# Altium schematic sheet pec.SchDoc: Parallella LCD Board
size A4; Author: Mateusz Majchrzycki; CompanyName: Antmicro Ltd; Address1: Zwierzyniecka 3; Address2: 60-813 Poznań; Address3: Poland; Address4: 60-813 Poznań, Poland; Revision: 2.1; SheetNumber: 1; SheetTotal: 2; PageSetup: Record=PageOptions|CenterHorizontal=True|CenterVertical=True|PrintScale=0.97|XCorrection=1.00|YCorrection=1.00|PrintKind=1|BorderSize=5000000|LeftOffset=0|BottomOffset=0|Orientation=2|PaperLength=2970|PaperWidth=2100|Scale=100|PaperSource=7|PrintQuality=600|MediaType=1|DitherType=10|PaperKind=A4|PrintScaleMode=1
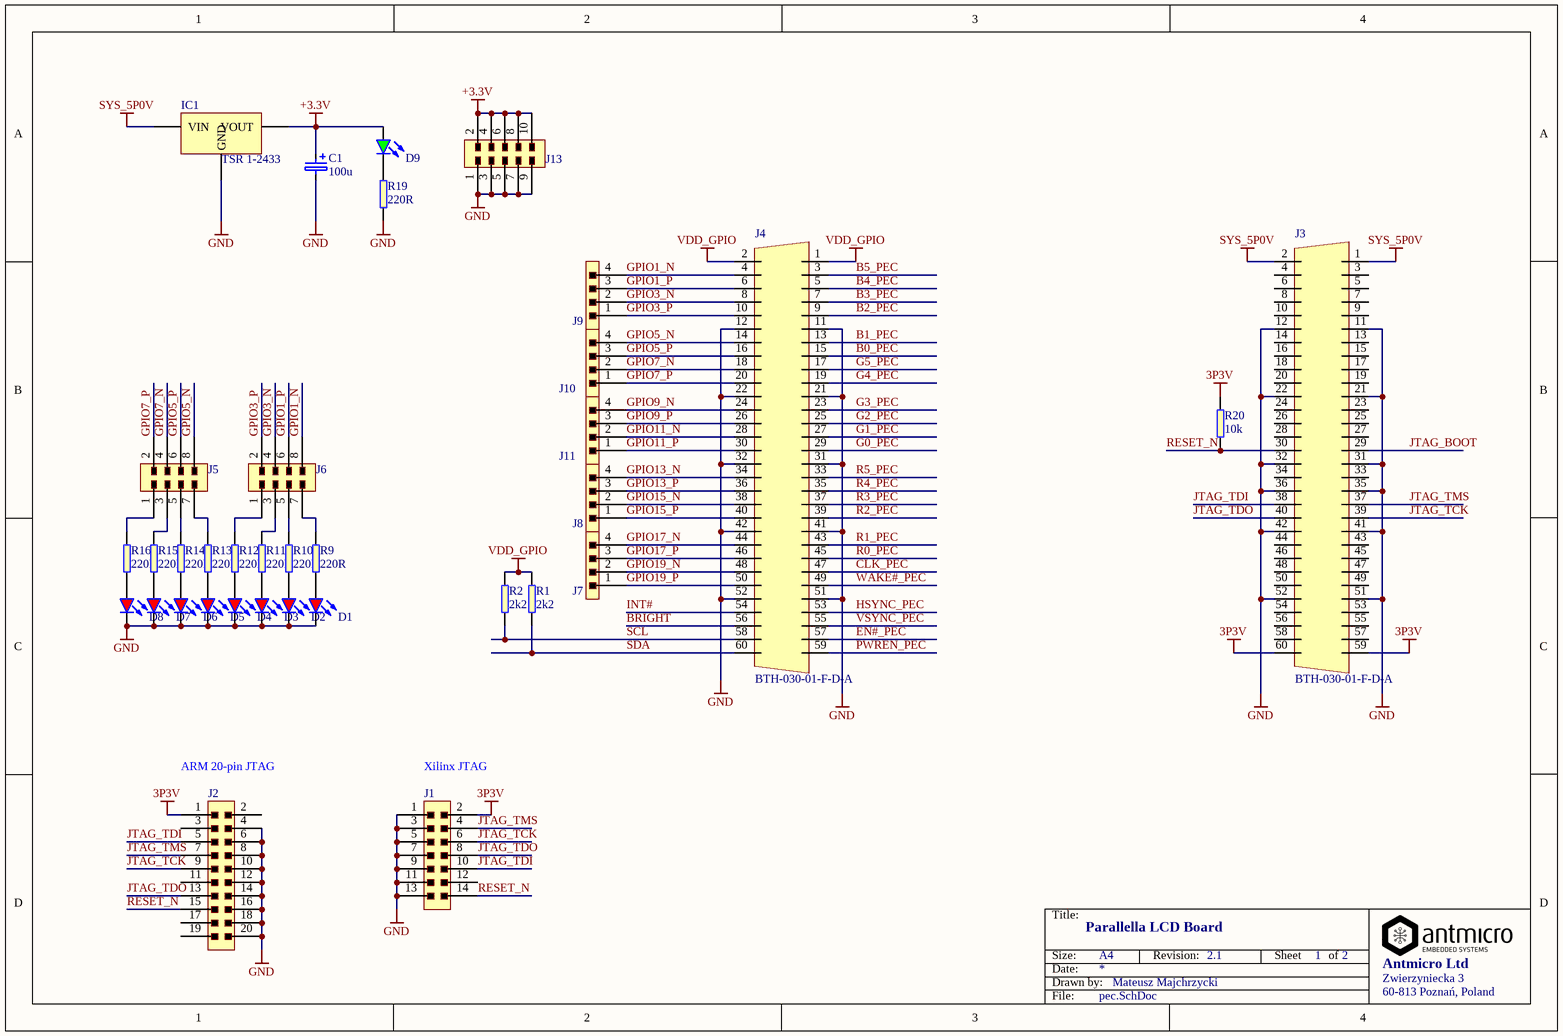
[diagram p0: pec.SchDoc]

## Parts
C1  100u  [KEMET_C]
D1  Red  [LED0603]  (value not drawn)
D2  Red  [LED0603]  (value not drawn)
D3  Red  [LED0603]  (value not drawn)
D4  Red  [LED0603]  (value not drawn)
D5  Red  [LED0603]  (value not drawn)
D6  Red  [LED0603]  (value not drawn)
D7  Red  [LED0603]  (value not drawn)
D8  Red  [LED0603]  (value not drawn)
D9  Green  [LED0603]  (value not drawn)
IC1  TSR 1-2433  [TSR1]
J1  Molex-87831-1420  [87831-1420]  (value not drawn)
J2  *  [HEADER_2X10_male 2.54mm]  (value not drawn)
J3  BTH-030-01-F-D-A  [BTH-030-01-F-D-A]
J4  BTH-030-01-F-D-A  [BTH-030-01-F-D-A]
J5  *  [HEADER_2X4_male 2mm]  (value not drawn)
J6  *  [HEADER_2X4_male 2mm]  (value not drawn)
J7  HEADER_1X4_male  [HEADER_1X4_male 2.54mm]  (value not drawn)
J8  HEADER_1X4_male  [HEADER_1X4_male 2.54mm]  (value not drawn)
J9  HEADER_1X4_male  [HEADER_1X4_male 2.54mm]  (value not drawn)
J10  HEADER_1X4_male  [HEADER_1X4_male 2.54mm]  (value not drawn)
J11  HEADER_1X4_male  [HEADER_1X4_male 2.54mm]  (value not drawn)
J13  *  [HEADER_2X5_male 2.54mm]  (value not drawn)
R1  2k2  [0603]
R2  2k2  [0603]
R9  220R  [0603]
R10  220R  [0603]
R11  220R  [0603]
R12  220R  [0603]
R13  220R  [0603]
R14  220R  [0603]
R15  220R  [0603]
R16  220R  [0603]
R19  220R  [0603]
R20  10k  [0603]

## Nets
3P3V: J1.2 J2.1 J3.59 J3.60 R20.2
+3.3V: C1.1 D9.A IC1.3(VOUT) J13.2 J13.4 J13.6 J13.8 J13.10
GND: C1.2 D1.K D2.K D3.K D4.K D5.K D6.K D7.K D8.K IC1.2(GND) J1.1 J1.3 J1.5 J1.7 J1.9 J1.11 J1.13 J2.4 J2.6 J2.8 J2.10 J2.12 J2.14 J2.16 J2.18 J2.20 J3.11 J3.12 J3.21 J3.22 J3.31 J3.32 J3.35 J3.36 J3.41 J3.42 J3.51 J3.52 J4.11 J4.12 J4.21 J4.22 J4.31 J4.32 J4.41 J4.42 J4.51 J4.52 J13.1 J13.3 J13.5 J13.7 J13.9 R19.1
SYS_5P0V: IC1.1(VIN) J3.1 J3.2
VDD_GPIO: J4.1 J4.2 R1.2 R2.2
B0_PEC: J4.15
B1_PEC: J4.13
B2_PEC: J4.9
B3_PEC: J4.7
B4_PEC: J4.5
B5_PEC: J4.3
BRIGHT: J4.56
CLK_PEC: J4.47
EN#_PEC: J4.57
G0_PEC: J4.29
G1_PEC: J4.27
G2_PEC: J4.25
G3_PEC: J4.23
G4_PEC: J4.19
G5_PEC: J4.17
GPIO1_N: J4.4 J6.8 J9.4
GPIO1_P: J4.6 J6.6 J9.3
GPIO3_N: J4.8 J6.4 J9.2
GPIO3_P: J4.10 J6.2 J9.1
GPIO5_N: J4.14 J5.8 J10.4
GPIO5_P: J4.16 J5.6 J10.3
GPIO7_N: J4.18 J5.4 J10.2
GPIO7_P: J4.20 J5.2 J10.1
GPIO9_N: J4.24 J11.4
GPIO9_P: J4.26 J11.3
GPIO11_N: J4.28 J11.2
GPIO11_P: J4.30 J11.1
GPIO13_N: J4.34 J8.4
GPIO13_P: J4.36 J8.3
GPIO15_N: J4.38 J8.2
GPIO15_P: J4.40 J8.1
GPIO17_N: J4.44 J7.4
GPIO17_P: J4.46 J7.3
GPIO19_N: J4.48 J7.2
GPIO19_P: J4.50 J7.1
HSYNC_PEC: J4.53
INT#: J4.54
JTAG_BOOT: J3.29
JTAG_TCK: J1.6 J2.9 J3.39
JTAG_TDI: J1.10 J2.5 J3.38
JTAG_TDO: J1.8 J2.13 J3.40
JTAG_TMS: J1.4 J2.7 J3.37
PWREN_PEC: J4.59
R0_PEC: J4.45
R1_PEC: J4.43
R2_PEC: J4.39
R3_PEC: J4.37
R4_PEC: J4.35
R5_PEC: J4.33
RESET_N: J1.14 J2.15 J3.30 R20.1
SCL: J4.58 R2.1
SDA: J4.60 R1.1
VSYNC_PEC: J4.55
WAKE#_PEC: J4.49
NetD1_A: D1.A R9.1
NetD2_A: D2.A R10.1
NetD3_A: D3.A R11.1
NetD4_A: D4.A R12.1
NetD5_A: D5.A R13.1
NetD6_A: D6.A R14.1
NetD7_A: D7.A R15.1
NetD8_A: D8.A R16.1
NetD9_K: D9.K R19.2
NetJ5_1: J5.1 R16.2
NetJ5_3: J5.3 R15.2
NetJ5_5: J5.5 R14.2
NetJ5_7: J5.7 R13.2
NetJ6_1: J6.1 R12.2
NetJ6_3: J6.3 R11.2
NetJ6_5: J6.5 R10.2
NetJ6_7: J6.7 R9.2

Not connected (* = marked no-connect by the designer): J1 12; J2 2 3 11 17 19; J3 3 4 5 6 7 8 9 10 13 14 15 16 17 18 19 20 23 24 25 26 27 28 33 34 43 44 45 46 47 48 49 50 53 54 55 56 57 58

## Notes on the sheet
- (near J2) ARM 20-pin JTAG
- (near J1) Xilinx JTAG
- Title:
- Size:
- Date:
- Drawn by:
- A4
- Revision:
- Sheet
- of
- File:

## Library data of the parts
C1 = C_100u_KEMET_C: Tantalum SMT Capacitor 100uF Case KEMET_C; Voltage: 10V; Value: 100u; Part Number: C_100u_KEMET_C; Component type: standard; Pin count: 2; Supplier 1: Farnell; Supplier Part Number 1: 2353063
D1-D8 = LED_R: LED Red 0603 case; Part Number: LED_R; Value: KPT-1608EC; Supplier 1: Farnell; Supplier Part Number 1: 2099221; Component Kind: Standard; Component Type: Standard; Library Reference: LED; Pin Count: 2
D9 = LED_G: LED Green 0603 case; Part Number: LED_G; Value: KPT-1608SGC; Supplier 1: Farnell; Supplier Part Number 1: 2099223; Component Kind: Standard; Component Type: Standard; Library Reference: LED; Pin Count: 2
IC1 = VREG: TRACOPOWER - TSR 1-2433 - CONVERTER, DC TO DC, 3.3V, 1A, SIP; Value: TSR 1-2433; Supplier 1: Farnell; Supplier Part Number 1: 1696319; ClassName: THT_Component; Component Type: Standard; Pin Count: 3
J1 = Molex-87831-1420: 2x7 pinhead male; Pitch: 2.0; Supplier 1: Farnell; Supplier Part Number 1: 7472285; Part Number: Molex-87831-1420; Component Kind: Standard; Component Type: Standard; Library Reference: HEADER_2X7_male; Pin Count: 14; ClassName: THT_Component; Value: 87831-1420
J2 = HEADER_2X10_male: 2x10 pinhead male; Part Number: HEADER_2X10_male; Component Kind: Standard; Component Type: Standard; Pin Count: 20; Supplier 1: Farnell; Supplier Part Number 1: 1022241; ClassName: THT_Component
J5 J6 = HEADER_2X4_male: 2x4 pinhead male; Part Number: HEADER_2X4_male; Component Kind: Standard; Component Type: Standard; Footprint: HEADER_2X4_male 2.54mm; Pin Count: 8; Supplier 1: Farnell; Supplier Part Number 1: 7472331; ClassName: THT_Component
J7-J11 = HEADER_1X4_male: 1x4 pinhead male; Supplier 1: Farnell; Supplier Part Number 1: 1022251; ClassName: THT_Component; Component Type: Standard; Pin Count: 4
J13 = HEADER_2X5_male: 2x5 pinhead male; Part Number: HEADER_2X5_male; Component Kind: Standard; Component Type: Standard; Pin Count: 10; ClassName: THT_Component
R1 R2 = R_2k2_0603: SMT Resistor 2k2 0603; Value: 2k2; Supplier 1: Farnell; Supplier Part Number 1: 2073429; Part Number: R_2k2_0603; Component type: standard; Pin count: 2
R9-R16 R19 = R_220R_0603: SMT Resistor 220R 0603; Value: 220R; Supplier 1: Farnell; Supplier Part Number 1: 2073428; Part Number: R_220R_0603; Component type: standard; Pin count: 2
R20 = R_10k_0603: SMT Resistor 10k 0603; Value: 10k; Supplier 1: Farnell; Supplier Part Number 1: 2008360; Part Number: R_10k_0603; Component type: standard; Pin count: 2
J3 J4 = BTH-030-01-F-D-A: Component Type: Standard; Pin Count: 60; Value: BTH-030-01-F-D-A